# Altium project xiaochequdongban.PrjPcb
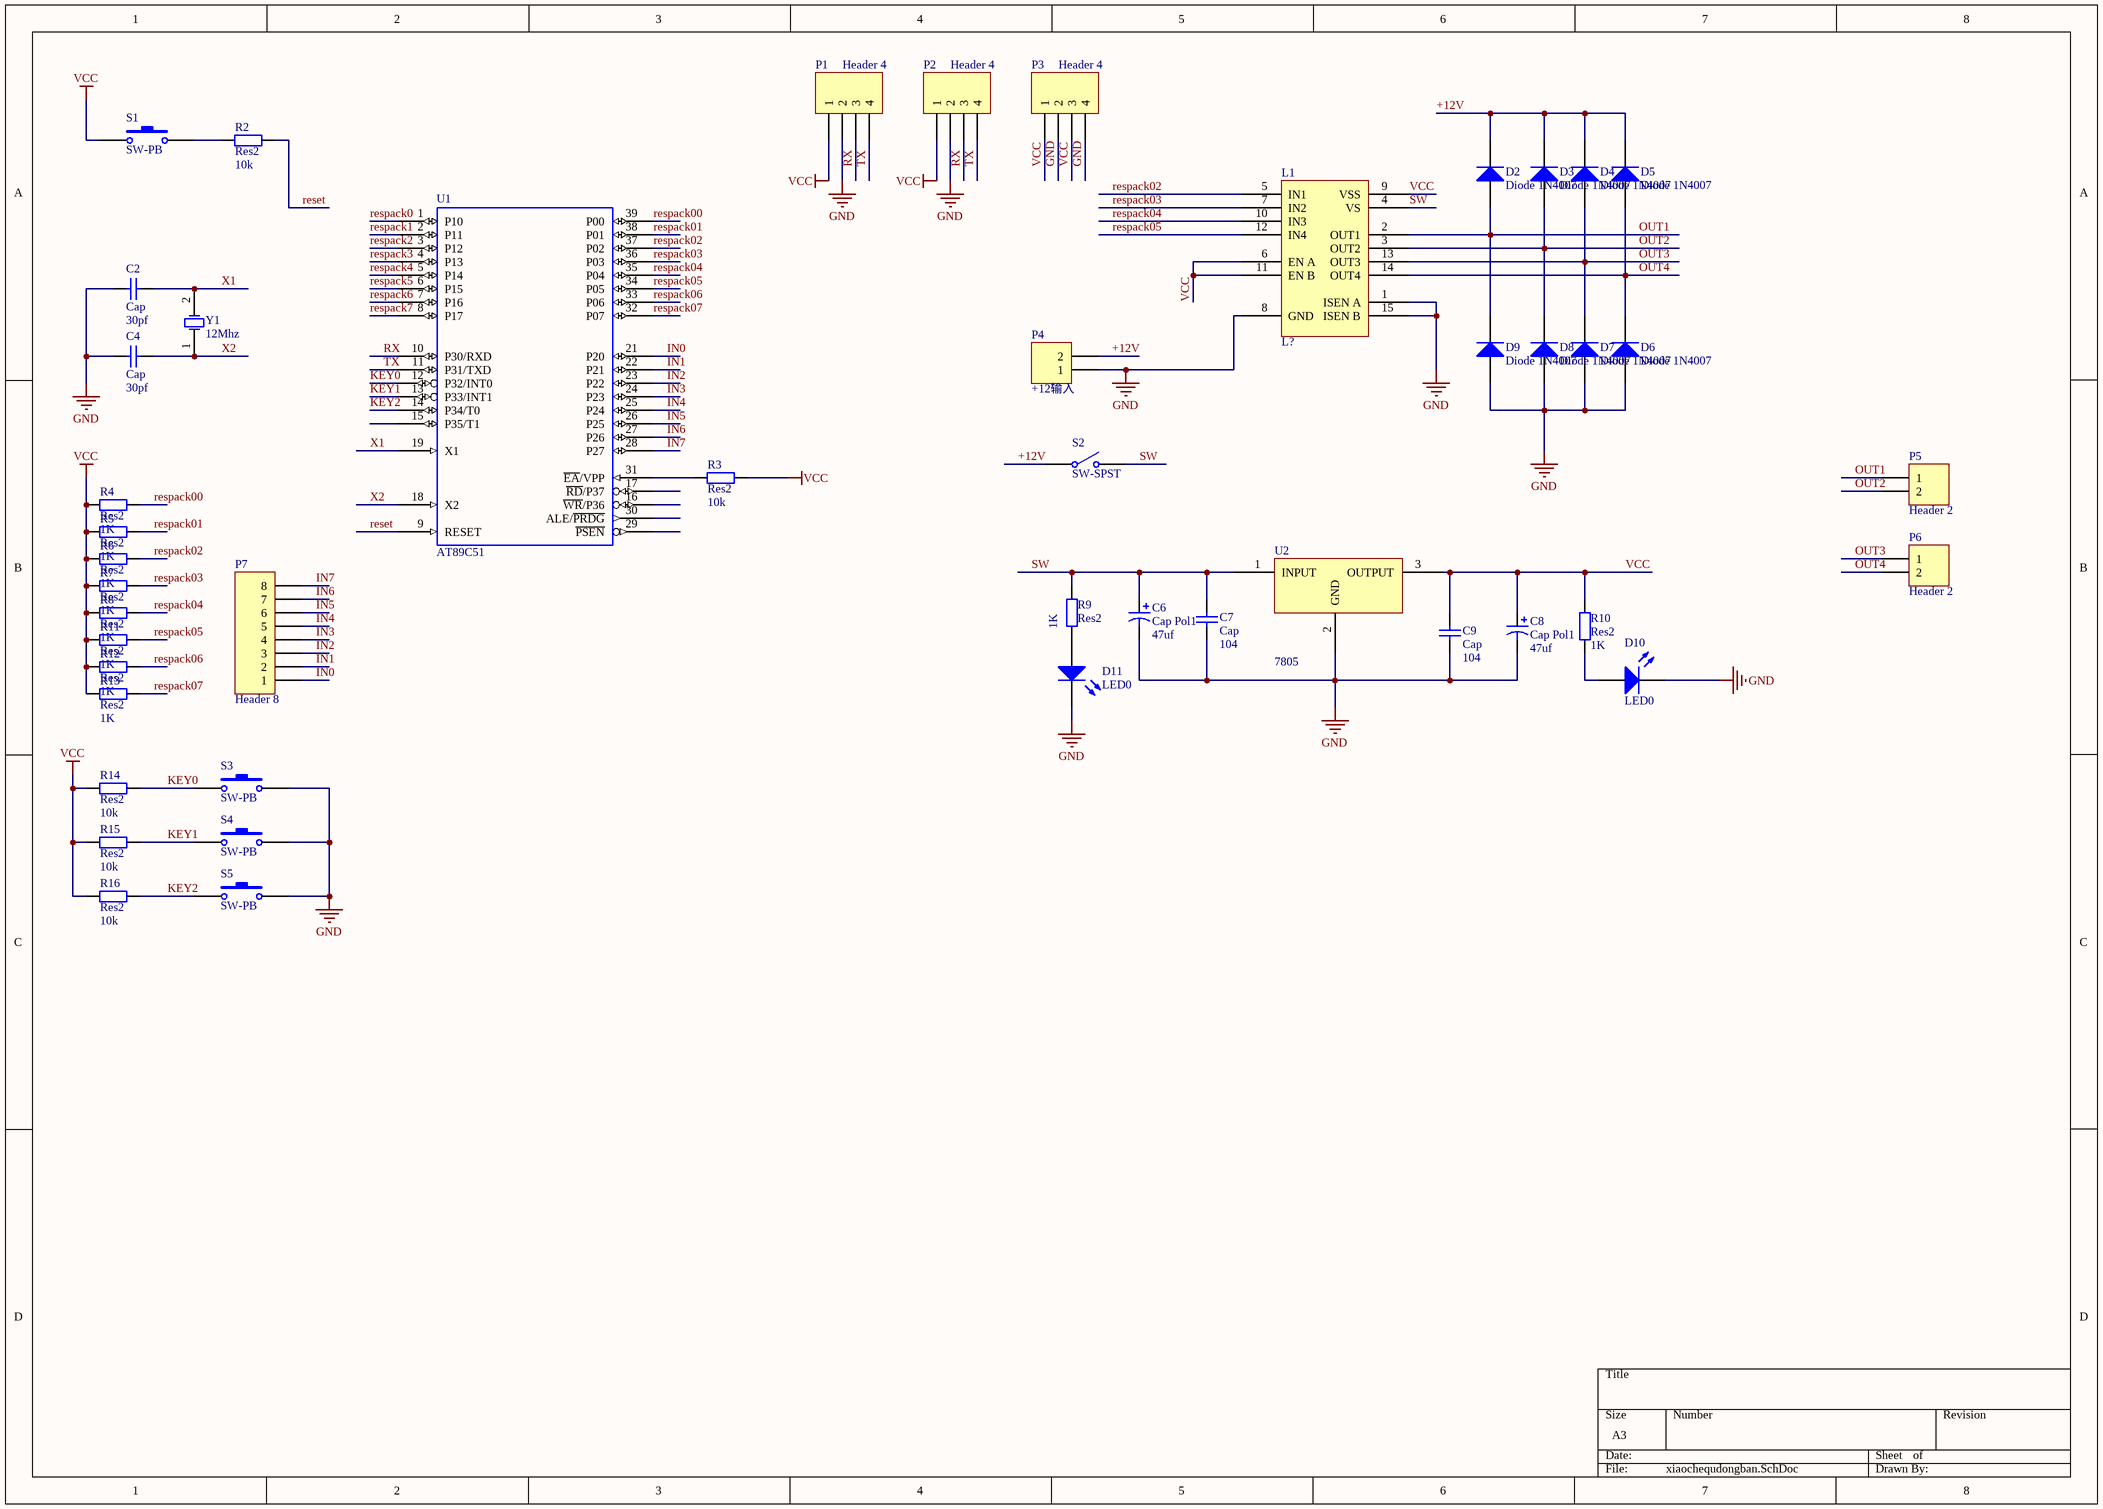
[diagram p0: xiaochequdongban.SchDoc]
1 sheet, 47 parts. Net scope: global (net labels, ports and power ports of the same name join across sheets).
Board file: xiaochequdongban.PcbDoc

## Sheet xiaochequdongban.SchDoc
size A3

### Parts
C2  Cap  value 30pf  [RAD0.1]
C4  Cap  value 30pf  [RAD0.1]
C6  Cap Pol1  value 47uf  [CAP-E]
C7  Cap  value 104  [RAD0.1]
C8  Cap Pol1  value 47uf  [CAP-E]
C9  Cap  value 104  [RAD0.1]
D2  Diode 1N4007  [DO-41]
D3  Diode 1N4007  [DO-41]
D4  Diode 1N4007  [DO-41]
D5  Diode 1N4007  [DO-41]
D6  Diode 1N4007  [DO-41]
D7  Diode 1N4007  [DO-41]
D8  Diode 1N4007  [DO-41]
D9  Diode 1N4007  [DO-41]
D10  LED0  [LED]
D11  LED0  [LED]
L1  L?  [L298N]
P1  Header 4  [HDR1X4]
P2  Header 4  [HDR1X4]
P3  Header 4  [HDR1X4]
P4  +12输入  [HDR1X2]
P5  Header 2  [SIP2]
P6  Header 2  [HDR1X2]
P7  Header 8  [HDR1X8]
R2  Res2  value 10k  [0805]
R3  Res2  value 10k  [0805]
R4  Res2  value 1K  [0805]
R5  Res2  value 1K  [0805]
R6  Res2  value 1K  [0805]
R7  Res2  value 1K  [0805]
R8  Res2  value 1K  [0805]
R9  Res2  value 1K  [AXIAL0.3]
R10  Res2  value 1K  [0805]
R11  Res2  value 1K  [0805]
R12  Res2  value 1K  [0805]
R13  Res2  value 1K  [0805]
R14  Res2  value 10k  [0805]
R15  Res2  value 10k  [0805]
R16  Res2  value 10k  [0805]
S1  SW-PB  [KeyA]
S2  SW-SPST  [SW-6pin]
S3  SW-PB  [KeyA]
S4  SW-PB  [KeyA]
S5  SW-PB  [KeyA]
U1  AT89C51  [DIP40]
U2  7805  [7805]
Y1  12Mhz  [XTAL]

### Nets
GND: C2.2 C4.2 C6.2 C7.1 C8.2 C9.1 D6.1(A) D7.1(A) D8.1(A) D9.1(A) D10.2(K) D11.2(K) L1.1(ISEN_A) L1.8(GND) L1.15(ISEN_B) P1.2 P2.2 P3.2 P3.4 P4.1 S3.2 S4.2 S5.2 U1.20(GND) U2.2(GND)
VCC: C8.1 C9.2 L1.6(EN_A) L1.9(VSS) L1.11(EN_B) P1.1 P2.1 P3.1 P3.3 R3.2 R4.1 R5.1 R6.1 R7.1 R8.1 R10.2 R11.1 R12.1 R13.1 R14.2 R15.2 R16.2 S1.1 U1.40(VCC) U2.3(OUTPUT)
+12V: D2.2(K) D3.2(K) D4.2(K) D5.2(K) P4.2 S2.1(COMMON)
IN0: P7.1 U1.21(P20)
IN1: P7.2 U1.22(P21)
IN2: P7.3 U1.23(P22)
IN3: P7.4 U1.24(P23)
IN4: P7.5 U1.25(P24)
IN5: P7.6 U1.26(P25)
IN6: P7.7 U1.27(P26)
IN7: P7.8 U1.28(P27)
KEY0: R14.1 S3.1 U1.12(P32/INT0)
KEY1: R15.1 S4.1 U1.13(P33/INT1)
KEY2: R16.1 S5.1 U1.14(P34/T0)
OUT1: D2.1(A) D9.2(K) L1.2(OUT1) P5.1
OUT2: D3.1(A) D8.2(K) L1.3(OUT2) P5.2
OUT3: D4.1(A) D7.2(K) L1.13(OUT3) P6.1
OUT4: D5.1(A) D6.2(K) L1.14(OUT4) P6.2
reset: R2.2 U1.9(RESET)
respack0: U1.1(P10)
respack00: R4.2 U1.39(P00)
respack1: U1.2(P11)
respack01: R5.2 U1.38(P01)
respack2: U1.3(P12)
respack02: L1.5(IN1) R6.2 U1.37(P02)
respack3: U1.4(P13)
respack03: L1.7(IN2) R7.2 U1.36(P03)
respack4: U1.5(P14)
respack04: L1.10(IN3) R8.2 U1.35(P04)
respack5: U1.6(P15)
respack05: L1.12(IN4) R11.2 U1.34(P05)
respack6: U1.7(P16)
respack06: R12.2 U1.33(P06)
respack7: U1.8(P17)
respack07: R13.2 U1.32(P07)
RX: P1.3 P2.3 U1.10(P30/RXD)
SW: C6.1 C7.2 L1.4(VS) R9.2 S2.2(NO) U2.1(INPUT)
TX: P1.4 P2.4 U1.11(P31/TXD)
X1: C2.1 U1.19(X1) Y1.2(OSC2)
X2: C4.1 U1.18(X2) Y1.1(OSC1)
NetD10_1: D10.1(A) R10.1
NetD11_1: D11.1(A) R9.1
NetR2_1: R2.1 S1.2
NetR3_1: R3.1 U1.31(~{EA}/VPP)

Not connected (* = marked no-connect by the designer): U1 15(P35/T1) 16(~{WR}/P36) 17(~{RD}/P37) 29(~{PSEN}) 30(ALE/~{PRDG})

### Library data of the parts
C2 C4 C7 C9 = Cap: Capacitor; Published: 8-Jun-2000; LatestRevisionDate: 17-Jul-2002; LatestRevisionNote: Re-released for DXP Platform.; PackageReference: RAD-0.3; Publisher: Altium Limited; PackageDescription: Radial Cap, Thru-Hole; 2 Leads; 0.3 in Pin Spacing
C6 C8 = Cap Pol1: Polarized Capacitor (Radial); Published: 8-Jun-2000; LatestRevisionDate: 17-Jul-2002; LatestRevisionNote: Re-released for DXP Platform.; PackageReference: RB7.6-15; Publisher: Altium Limited; PackageDescription: Polarized Capacitor (Radial); 2 Leads
D2-D9 = Diode 1N4007: 1 Amp General Purpose Rectifier; Published: 8-Jun-2000; LatestRevisionDate: 17-Jul-2002; LatestRevisionNote: Re-released for DXP Platform.; DatasheetVersion: 1998; PackageVersion: Aug-1999; PackageReference: DO-41; Publisher: Altium Limited; PackageDescription: Diode, Axial; Body 5.2 x 2.7 mm (LxDia. max), Lead Dia. 0.86 mm (max); Code_JEDEC: DO-204-AL; ComponentLink1Description: Manufacturer Link; ComponentLink1URL: http://www.fairchildsemi.com/; ComponentLink2Description: Datasheet; ComponentLink2URL: http://www.fairchildsemi.com/ds/1N%2F1N4001.pdf
D10 D11 = LED0: Typical INFRARED GaAs LED; Published: 8-Jun-2000; LatestRevisionDate: 08-Jul-2005; LatestRevisionNote: Mech Layer 1 removed.; PackageReference: LED-0; Publisher: Altium Limited; PackageDescription: LED; 2 Leads
L1 = L298N
P1-P3 = Header 4: Header, 4-Pin; LatestRevisionDate: 17-Jul-2002; LatestRevisionNote: Re-released for DXP Platform.; Publisher: Altium Limited
P4-P6 = Header 2: Header, 2-Pin; LatestRevisionDate: 17-Jul-2002; LatestRevisionNote: Re-released for DXP Platform.; Publisher: Altium Limited
P7 = Header 8: Header, 8-Pin; LatestRevisionDate: 17-Jul-2002; LatestRevisionNote: Re-released for DXP Platform.; Publisher: Altium Limited
R2-R16 = Res2: Resistor; Published: 8-Jun-2000; LatestRevisionDate: 17-Jul-2002; LatestRevisionNote: Re-released for DXP Platform.; PackageReference: AXIAL-0.4; Publisher: Altium Limited; PackageDescription: Axial Device, Thru-Hole; 2 Leads; 0.4 in Pin Spacing
S1 S3-S5 = SW-PB: Switch; Published: 24-Mar-1999; LatestRevisionDate: 17-Jul-2002; LatestRevisionNote: Re-released for DXP Platform.; PackageReference: SPST-2; Publisher: Altium Limited; PackageDescription: Switch; 2 Leads
S2 = SW-SPST: Single-Pole, Single-Throw Switch; Published: 24-Mar-1999; LatestRevisionDate: 17-Jul-2002; LatestRevisionNote: Re-released for DXP Platform.; PackageReference: SPST-2; Publisher: Altium Limited; PackageDescription: Switch; 2 Leads
Y1 = XTAL: Crystal Oscillator; Published: 8-Jun-2000; LatestRevisionDate: 17-Jul-2002; LatestRevisionNote: Re-released for DXP Platform.; PackageReference: R38; Publisher: Altium Limited; PackageDescription: Crystal, Thru-Hole; 2 Leads; Body 3.1 x 8.2 mm (Dia.xH)